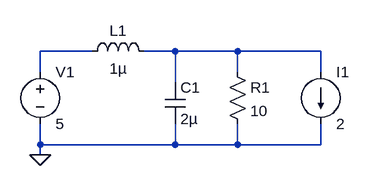
[diagram p0: schematic sample.asc]
sample.asc, the LTspice schematic file:
Version 4
SHEET 1 880 680
WIRE 160 96 80 96
WIRE 288 96 240 96
WIRE 384 96 288 96
WIRE 512 96 384 96
WIRE 80 128 80 96
WIRE 384 128 384 96
WIRE 512 128 512 96
WIRE 288 144 288 96
WIRE 80 240 80 208
WIRE 288 240 288 208
WIRE 288 240 80 240
WIRE 384 240 384 208
WIRE 384 240 288 240
WIRE 512 240 512 208
WIRE 512 240 384 240
WIRE 80 256 80 240
FLAG 80 256 0
SYMBOL voltage 80 112 R0
WINDOW 123 0 0 Left 0
WINDOW 39 0 0 Left 0
SYMATTR InstName V1
SYMATTR Value 5
SYMBOL ind 144 112 R270
WINDOW 0 32 56 VTop 2
WINDOW 3 5 56 VBottom 2
SYMATTR InstName L1
SYMATTR Value 1µ
SYMBOL cap 272 144 R0
SYMATTR InstName C1
SYMATTR Value 2µ
SYMBOL res 368 112 R0
SYMATTR InstName R1
SYMATTR Value 10
SYMBOL current 512 128 R0
WINDOW 123 0 0 Left 0
WINDOW 39 0 0 Left 0
SYMATTR InstName I1
SYMATTR Value 2

The netlist it stands for:
* sample.asc
V1 N001 0 5
L1 N001 N002 1µ
C1 N002 0 2µ
R1 N002 0 10
I1 N002 0 2
.backanno
.end